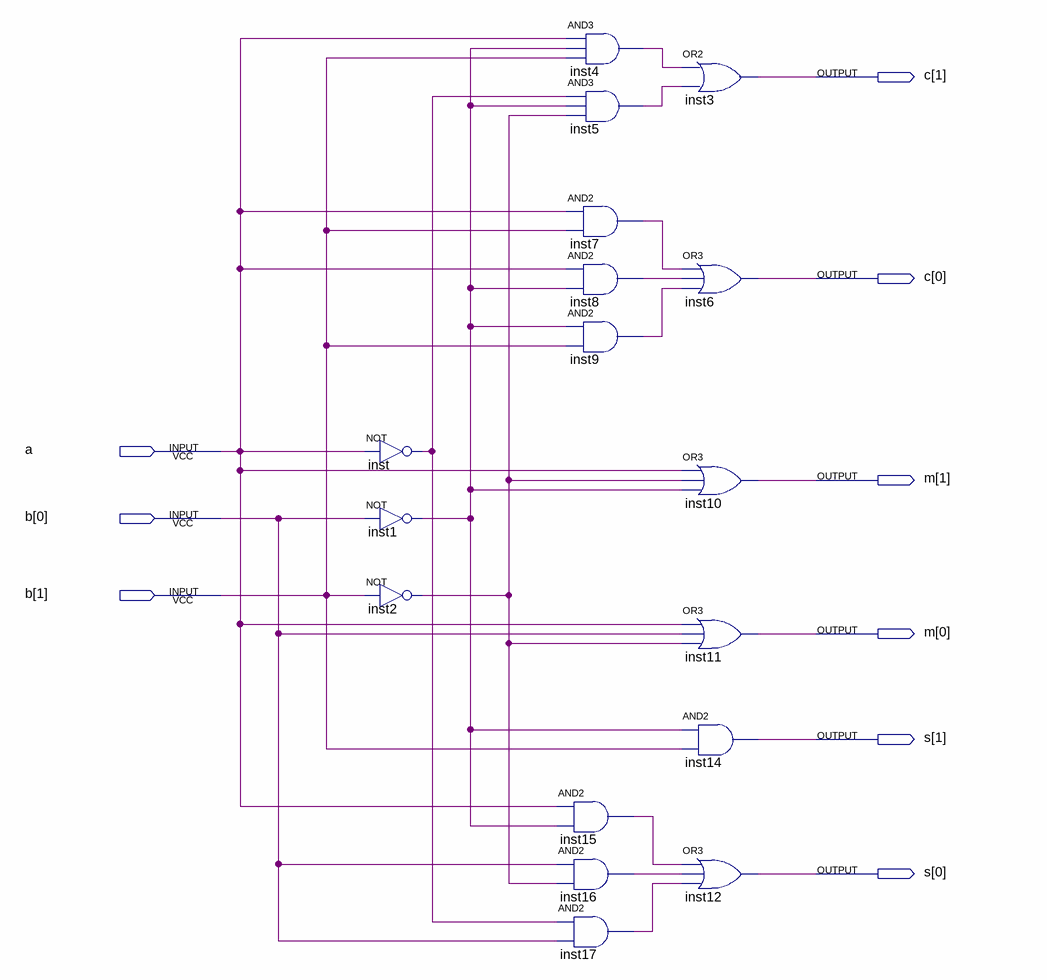
[diagram p0: schematic sheet]
// Quartus schematic lab11_sch.bdf as structural Verilog: 17 symbols, 9 pins
module lab11_sch (
  input  a,
  input  [1:0] b,
  output [1:0] c,
  output [1:0] m,
  output [1:0] s
);

  wire inst1_out, inst2_out, inst4_out, inst5_out, inst7_out, inst8_out, inst9_out, inst15_out, inst16_out,
       inst17_out, inst_out;

  not inst (inst_out, a);
  not inst1 (inst1_out, b[0]);
  not inst2 (inst2_out, b[1]);
  and inst4 (inst4_out, a, inst1_out, b[1]);
  and inst5 (inst5_out, inst_out, inst1_out, inst2_out);
  and inst7 (inst7_out, a, b[1]);
  and inst8 (inst8_out, a, inst1_out);
  and inst9 (inst9_out, inst1_out, b[1]);
  and inst15 (inst15_out, a, inst1_out);
  and inst16 (inst16_out, b[0], inst2_out);
  and inst17 (inst17_out, inst_out, b[0]);
  or inst3 (c[1], inst4_out, inst5_out);
  or inst6 (c[0], inst7_out, inst8_out, inst9_out);
  or inst10 (m[1], a, inst2_out, inst1_out);
  or inst11 (m[0], a, b[0], inst2_out);
  and inst14 (s[1], inst1_out, b[1]);
  or inst12 (s[0], inst15_out, inst16_out, inst17_out);
endmodule
